# EAGLE schematic Arduino (EAGLE 9.1.3)
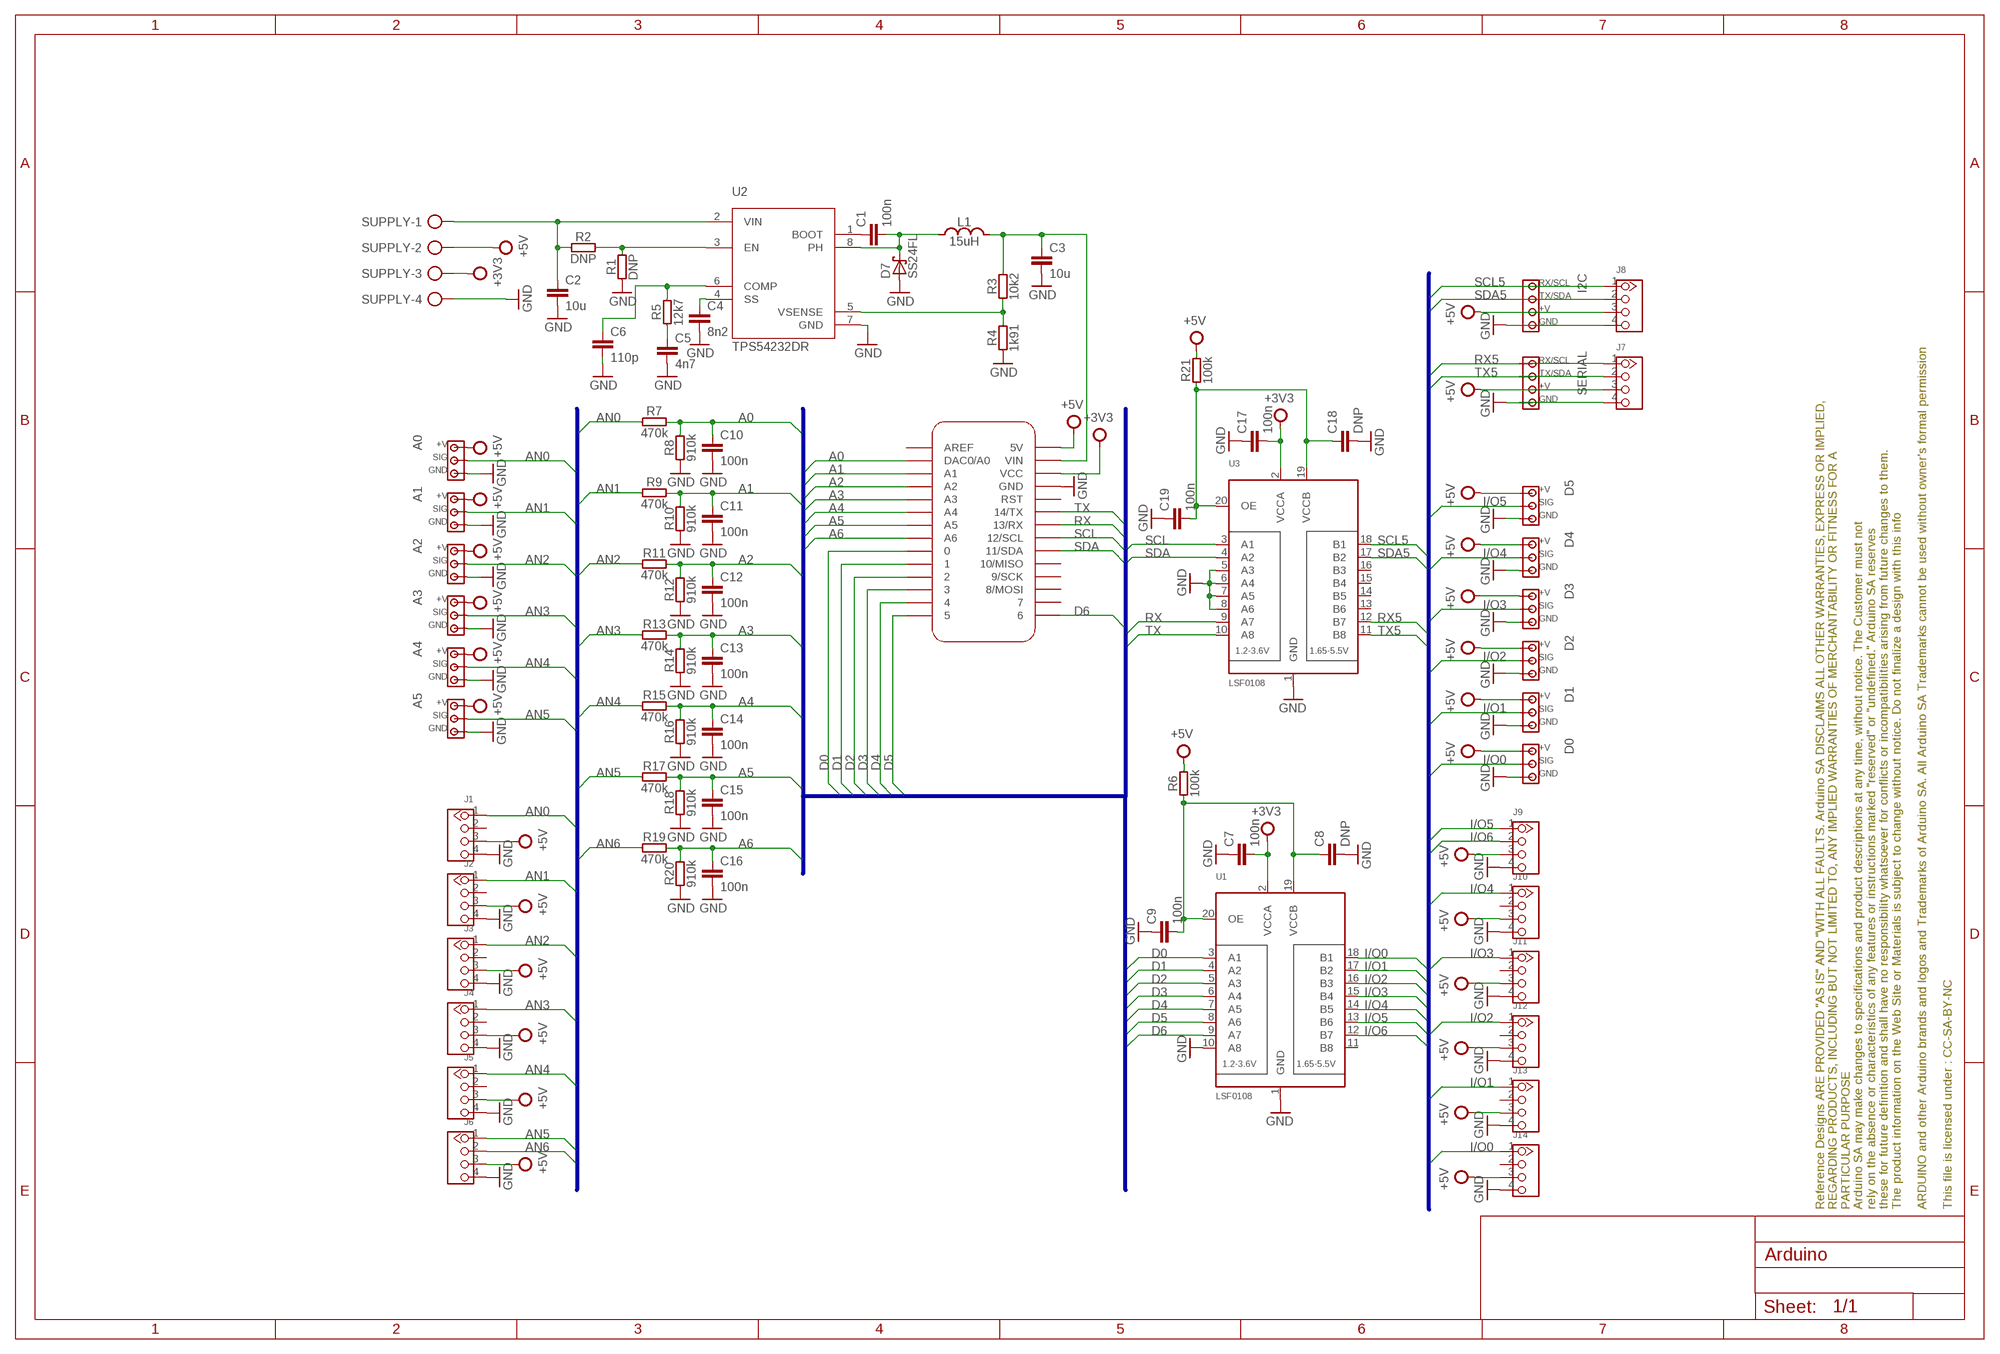
[diagram p0: schematic, sheet 1]

## Parts
A0  DNP  MODULINO-3-DNPSM  [MODULINO-3SM]
A1  DNP  MODULINO-3-DNPSM  [MODULINO-3SM]
A2  DNP  MODULINO-3-DNPSM  [MODULINO-3SM]
A3  DNP  MODULINO-3-DNPSM  [MODULINO-3SM]
A4  DNP  MODULINO-3-DNPSM  [MODULINO-3SM]
A5  DNP  MODULINO-3-DNPSM  [MODULINO-3SM]
B1  DNP  MKRBOARDNO-OUTLINE  [MKRBOARD-NOOUTLINE]
C1  100n  C-100NF-0402  [0402-1005X55N]
C2  10u  C-10UF-0603  [0603-1608X90N]
C3  10u  C-10UF-0603  [0603-1608X90N]
C4  8n2  C-8N2-0402  [0402-1005X55N]
C5  4n7  C-4N7-0402  [0402-1005X55N]
C6  110p  C-110P-0402  [0402-1005X55N]
C7  100n  C-100NF-0402  [0402-1005X55N]
C8  DNP  CDNP-0402  [0402-1005X55N]
C9  100n  C-100NF-0402  [0402-1005X55N]
C10  100n  C-100NF-0402  [0402-1005X55N]
C11  100n  C-100NF-0402  [0402-1005X55N]
C12  100n  C-100NF-0402  [0402-1005X55N]
C13  100n  C-100NF-0402  [0402-1005X55N]
C14  100n  C-100NF-0402  [0402-1005X55N]
C15  100n  C-100NF-0402  [0402-1005X55N]
C16  100n  C-100NF-0402  [0402-1005X55N]
C17  100n  C-100NF-0402  [0402-1005X55N]
C18  DNP  CDNP-0402  [0402-1005X55N]
C19  100n  C-100NF-0402  [0402-1005X55N]
D0  DNP  MODULINO-3-DNPSM  [MODULINO-3SM]
D1  DNP  MODULINO-3-DNPSM  [MODULINO-3SM]
D2  DNP  MODULINO-3-DNPSM  [MODULINO-3SM]
D3  DNP  MODULINO-3-DNPSM  [MODULINO-3SM]
D4  DNP  MODULINO-3-DNPSM  [MODULINO-3SM]
D5  DNP  MODULINO-3-DNPSM  [MODULINO-3SM]
D7  SS24FL  [SOD123F]
FRAME1  DNP  A3-FRAME-STANDARD  [FRAME]
I2C  DNP  MODULINO-4-DNPSM  [MODULINO-4SM]
J1  -  GROVE-CONNECTOR  [HW4-2.0]
J2  -  GROVE-CONNECTOR  [HW4-2.0]
J3  -  GROVE-CONNECTOR  [HW4-2.0]
J4  -  GROVE-CONNECTOR  [HW4-2.0]
J5  -  GROVE-CONNECTOR  [HW4-2.0]
J6  -  GROVE-CONNECTOR  [HW4-2.0]
J7  -  GROVE-CONNECTOR  [HW4-2.0]
J8  -  GROVE-CONNECTOR  [HW4-2.0]
J9  -  GROVE-CONNECTOR  [HW4-2.0]
J10  -  GROVE-CONNECTOR  [HW4-2.0]
J11  -  GROVE-CONNECTOR  [HW4-2.0]
J12  -  GROVE-CONNECTOR  [HW4-2.0]
J13  -  GROVE-CONNECTOR  [HW4-2.0]
J14  -  GROVE-CONNECTOR  [HW4-2.0]
L1  15uH  LSRN  [SRN6045]
R1  DNP  R-DNP-0402  [0402-1005X55N]
R2  DNP  R-DNP-0402  [0402-1005X55N]
R3  10k2  R-10K2-0402  [0402-1005X55N]
R4  1k91  R-1K91-0402  [0402-1005X55N]
R5  12k7  R-12K7-0402  [0402-1005X55N]
R6  100k  R-100K-0402  [0402-1005X55N]
R7  470k  R-470K-0402  [0402-1005X55N]
R8  910k  R-910K-0402  [0402-1005X55N]
R9  470k  R-470K-0402  [0402-1005X55N]
R10  910k  R-910K-0402  [0402-1005X55N]
R11  470k  R-470K-0402  [0402-1005X55N]
R12  910k  R-910K-0402  [0402-1005X55N]
R13  470k  R-470K-0402  [0402-1005X55N]
R14  910k  R-910K-0402  [0402-1005X55N]
R15  470k  R-470K-0402  [0402-1005X55N]
R16  910k  R-910K-0402  [0402-1005X55N]
R17  470k  R-470K-0402  [0402-1005X55N]
R18  910k  R-910K-0402  [0402-1005X55N]
R19  470k  R-470K-0402  [0402-1005X55N]
R20  910k  R-910K-0402  [0402-1005X55N]
R21  100k  R-100K-0402  [0402-1005X55N]
SERIAL  DNP  MODULINO-4-DNPSM  [MODULINO-4SM]
SUPPLY  -  AK300/4  [AK300/4]
U1  LSF0108  LSF0108PWR  [TSSOP20]
U2  TPS54232DR  TPS54232  [SO08]
U3  LSF0108  LSF0108PWR  [TSSOP20]

## Nets
+3V3: B1.VCC C7.2 C17.2 SUPPLY.3 U1.2(VCCA) U3.2(VCCA)
+5V: A0.1 A1.1 A2.1 A3.1 A4.1 A5.1 B1.5V D0.1 D1.1 D2.1 D3.1 D4.1 D5.1 I2C.3 J1.3 J2.3 J3.3 J4.3 J5.3 J6.3 J7.3 J8.3 J9.3 J10.3 J11.3 J12.3 J13.3 J14.3 R6.2 R21.2 SERIAL.3 SUPPLY.2
A0: B1.A0(DAC0/A0) C10.1 R7.2 R8.2
A1: B1.A1 C11.1 R9.2 R10.2
A2: B1.A2 C12.1 R11.2 R12.2
A3: B1.A3 C13.1 R13.2 R14.2
A4: B1.A4 C14.1 R15.2 R16.2
A5: B1.A5 C15.1 R17.2 R18.2
A6: B1.A6 C16.1 R19.2 R20.2
AN0: A0.2 J1.1 R7.1
AN1: A1.2 J2.1 R9.1
AN2: A2.2 J3.1 R11.1
AN3: A3.2 J4.1 R13.1
AN4: A4.2 J5.1 R15.1
AN5: A5.2 J6.1 R17.1
AN6: J6.2 R19.1
D0: B1.0 U1.3(A1)
D1: B1.1 U1.4(A2)
D2: B1.2 U1.5(A3)
D3: B1.3 U1.6(A4)
D4: B1.4 U1.7(A5)
D5: B1.5 U1.8(A6)
D6: B1.6 U1.9(A7)
GND: A0.3 A1.3 A2.3 A3.3 A4.3 A5.3 B1.GND C2.2 C3.2 C4.2 C5.2 C6.2 C7.1 C8.2 C9.1 C10.2 C11.2 C12.2 C13.2 C14.2 C15.2 C16.2 C17.1 C18.2 C19.1 D0.3 D1.3 D2.3 D3.3 D4.3 D5.3 D7.A I2C.4 J1.4 J2.4 J3.4 J4.4 J5.4 J6.4 J7.4 J8.4 J9.4 J10.4 J11.4 J12.4 J13.4 J14.4 R1.1 R4.1 R8.1 R10.1 R12.1 R14.1 R16.1 R18.1 R20.1 SERIAL.4 SUPPLY.4 U1.1(GND) U1.10(A8) U2.7(GND) U3.1(GND) U3.5(A3) U3.6(A4) U3.7(A5) U3.8(A6)
I/O0: D0.2 J14.1 U1.18(B1)
I/O1: D1.2 J13.1 U1.17(B2)
I/O2: D2.2 J12.1 U1.16(B3)
I/O3: D3.2 J11.1 U1.15(B4)
I/O4: D4.2 J10.1 U1.14(B5)
I/O5: D5.2 J9.1 U1.13(B6)
I/O6: J9.2 U1.12(B7)
N$1: C2.1 R2.1 SUPPLY.1 U2.2(VIN)
N$2: R1.2 R2.2 U2.3(EN)
N$3: C1.1 U2.1(BOOT)
N$4: C1.2 D7.C L1.1 U2.8(PH)
N$5: C4.1 U2.4(SS)
N$6: R3.1 R4.2 U2.5(VSENSE)
N$7: C6.1 R5.2 U2.6(COMP)
N$8: C5.1 R5.1
N$9: C8.1 C9.2 R6.1 U1.19(VCCB) U1.20(OE)
N$10: C18.1 C19.2 R21.1 U3.19(VCCB) U3.20(OE)
RX: B1.13(13/RX) U3.9(A7)
RX5: J7.1 SERIAL.1 U3.12(B7)
SCL: B1.12(12/SCL) U3.3(A1)
SCL5: I2C.1 J8.1 U3.18(B1)
SDA: B1.11(11/SDA) U3.4(A2)
SDA5: I2C.2 J8.2 U3.17(B2)
TX: B1.14(14/TX) U3.10(A8)
TX5: J7.2 SERIAL.2 U3.11(B8)
VIN: B1.VIN C3.1 L1.2 R3.2
Unconnected: B1.7 B1.8(8/MOSI) B1.9(9/SCK) B1.10(10/MISO) B1.AREF B1.RST J1.2 J2.2 J3.2 J4.2 J5.2 J10.2 J11.2 J12.2 J13.2 J14.2 U1.11(B8) U3.13(B6) U3.14(B5) U3.15(B4) U3.16(B3)

## Buses
A0,A1,A2,A3,A4,A5,A6,VA0,VA1,VA2,VA3,VA4,VA5,VA6
D0,D1,D2,D3,D4,D5,D6,VD0,VD1,VD2,VD3,VD4,VD5,VD6,SDA,SCL,TX,RX
B$1
B$2

## Library data of the parts
A0 A1-A5 D0 D1-D5 = Arduino-connectors:MODULINO-3: Modulino 4 connector; DATASHEET: DNP; DISTRIBUTOR-LINK: DNP; DISTRIBUTOR-PN: DNP; MANUFACTURER: DNP; MANUFACTURER-PN: DNP
B1 = Arduino-utility:MKRBOARD: MKR board footprint; CODE-ARDUINO: DNP; DATASHEET: DNP; DISTRIBUTOR-LINK: DNP; DISTRIBUTOR-PN: DNP; MANUFACTURER: DNP; MANUFACTURER-PN: DNP
C1 C7 C9-C17 C19 = Arduino-rcl:C: SMD Capacitor; CODE-ARDUINO: 0132; DATASHEET: http://www.tdk.com/pdf/TDKMLCCCapRange.pdf; DISTRIBUTOR-LINK: http://www.digikey.com/product-detail/en/tdk-corporation/C1005X5R1H104K050BB/445-5942-1-ND/2443982; DISTRIBUTOR-PN: 445-5942-1-ND; MANUFACTURER: TDK; MANUFACTURER-PN: C1005X5R1H104K050BB
C2 C3 = Arduino-rcl:C: SMD Capacitor; CODE-ARDUINO: 2213; DATASHEET: http://www.murata.com/~/media/webrenewal/support/library/catalog/products/capacitor/mlcc/c02e.pdf; DISTRIBUTOR-LINK: http://www.digikey.com/product-search/en?keywords=490-10728-1-ND; DISTRIBUTOR-PN: 490-10728-1-ND; MANUFACTURER: Murata; MANUFACTURER-PN: GRM188R61C106KAALD
C4 = Arduino-rcl:C: SMD Capacitor; CODE-ARDUINO: 2263; DATASHEET: http://www.yageo.com/documents/recent/UPY-GPHC_X7R_6.3V-to-50V_18.pdf; DISTRIBUTOR-LINK: https://www.digikey.com/product-detail/en/yageo/CC0402KRX7R7BB822/311-1041-1-ND/302958; DISTRIBUTOR-PN: 311-1041-1-ND; MANUFACTURER: Yageo; MANUFACTURER-PN: CC0402KRX7R7BB822
C5 = Arduino-rcl:C: SMD Capacitor; CODE-ARDUINO: 2266; DATASHEET: http://search.murata.co.jp/Ceramy/image/img/A01X/partnumbering_e_01.pdf; DISTRIBUTOR-LINK: https://www.digikey.com/product-detail/en/murata-electronics-north-america/GRM155R71H472KA01J/490-8259-1-ND/4380553; DISTRIBUTOR-PN: 490-8259-1-ND; MANUFACTURER: Murata; MANUFACTURER-PN: GRM155R71H472KA01J
C6 = Arduino-rcl:C: SMD Capacitor; CODE-ARDUINO: 2264; DATASHEET: http://search.murata.co.jp/Ceramy/image/img/A01X/G101/ENG/GRM1555C1H111GA01-01.pdf; DISTRIBUTOR-LINK: https://www.digikey.com/product-detail/en/murata-electronics-north-america/GRM1555C1H111GA01D/490-6195-1-ND/3845392; DISTRIBUTOR-PN: 490-6195-1-ND; MANUFACTURER: Murata; MANUFACTURER-PN: GRM1555C1H111GA01D
C8 C18 = Arduino-rcl:C: SMD Capacitor; CODE-ARDUINO: DNP; DATASHEET: DNP; DISTRIBUTOR-LINK: DNP; DISTRIBUTOR-PN: DNP; MANUFACTURER: DNP; MANUFACTURER-PN: DNP
D7 = Arduino-diodes:SS24FL: Schotky diode; CODE-ARDUINO: 2262; DATASHEET: https://www.fairchildsemi.com/datasheets/SS/SS24FL.pdf; DISTRIBUTOR-LINK: https://www.digikey.com/product-detail/en/fairchild-on-semiconductor/SS24FL/SS24FLCT-ND/5305093; DISTRIBUTOR-PN: SS24FLCT-ND; MANUFACTURER: Fairchild; MANUFACTURER-PN: SS24FL
FRAME1 = Arduino-utility:A3-FRAME: Schematic frame; CODE-ARDUINO: DNP; DATASHEET: DNP; DISTRIBUTOR-LINK: DNP; DISTRIBUTOR-PN: DNP; MANUFACTURER: DNP; MANUFACTURER-PN: DNP
I2C SERIAL = Arduino-connectors:MODULINO-4: Modulino 4 connector; DATASHEET: DNP; DISTRIBUTOR-LINK: DNP; DISTRIBUTOR-PN: DNP; MANUFACTURER: DNP; MANUFACTURER-PN: DNP
J1-J14 = Arduino-connectors:GROVE-CONNECTOR: Grove connector; CODE-ARDUINO: 2340; DATASHEET: http://www.jst-mfg.com/product/pdf/eng/ePH.pdf; DISTRIBUTOR-LINK: https://www.digikey.com/product-detail/en/jst-sales-america-inc/B4B-PH-K-S(LF)(SN)/455-1706-ND/926613; DISTRIBUTOR-PN: 455-1706-ND; MANUFACTURER: JST; MANUFACTURER-PN: B4B-PH-K-S(LF)(SN)
L1 = Arduino-rcl:L: Inductors; CODE-ARDUINO: 2261; DATASHEET: http://pdf1.alldatasheet.com/datasheet-pdf/view/442254/BOURNS/SRN6045-150M.html; DISTRIBUTOR-LINK: https://www.digikey.com/product-detail/en/bourns-inc/SRN6045-150M/SRN6045-150MCT-ND/2756165; DISTRIBUTOR-PN: SRN6045-150M; MANUFACTURER: Bourns; MANUFACTURER-PN: SRN6045-150M
R1 R2 = Arduino-rcl:R: SMD Resistor; CODE-ARDUINO: DNP; DATASHEET: DNP; DISTRIBUTOR-LINK: DNP; DISTRIBUTOR-PN: DNP; MANUFACTURER: DNP; MANUFACTURER-PN: DNP; _RESTRICTIONS: NO
R3 = Arduino-rcl:R: SMD Resistor; CODE-ARDUINO: 2265; DATASHEET: www.yageo.com.tw/exep/pages/download/literatures/PYu-R_INT-thick_7.pdf; DISTRIBUTOR-LINK: https://www.digikey.com/product-detail/en/yageo/RT0402DRD0710K2L/311-2129-1-ND/6128548; DISTRIBUTOR-PN: 311-2129-1-ND; MANUFACTURER: Yageo; MANUFACTURER-PN: RT0402DRD0710K2L; _RESTRICTIONS: NO
R4 = Arduino-rcl:R: SMD Resistor; CODE-ARDUINO: 2267; DATASHEET: www.yageo.com.tw/exep/pages/download/literatures/PYu-R_INT-thick_7.pdf; DISTRIBUTOR-LINK: https://www.digikey.com/product-detail/en/yageo/RC0402FR-071K91L/YAG3049CT-ND/5281914; DISTRIBUTOR-PN: YAG3049CT-ND; MANUFACTURER: Yageo; MANUFACTURER-PN: RC0402FR-071K91L; _RESTRICTIONS: NO
R5 = Arduino-rcl:R: SMD Resistor; CODE-ARDUINO: 2260; DATASHEET: www.yageo.com.tw/exep/pages/download/literatures/PYu-R_INT-thick_7.pdf; DISTRIBUTOR-LINK: https://www.digikey.com/product-detail/en/yageo/RC0402FR-0712K7L/YAG2964CT-ND/5281829; DISTRIBUTOR-PN: YAG2964CT-ND; MANUFACTURER: Yageo; MANUFACTURER-PN: RC0402FR-0712K7L; _RESTRICTIONS: NO
R6 R21 = Arduino-rcl:R: SMD Resistor; CODE-ARDUINO: 0134; DATASHEET: www.yageo.com.tw/exep/pages/download/literatures/PYu-R_INT-thick_7.pdf; DISTRIBUTOR-LINK: http://www.digikey.com/product-detail/en/yageo/RC0402FR-07100KL/311-100KLRCT-ND/729473; DISTRIBUTOR-PN: 311-100KLRCT-ND; MANUFACTURER: Yageo; MANUFACTURER-PN: RC0402FR-07100KL; _RESTRICTIONS: NO
R7 R9 R11 R13 R15 R17 R19 = Arduino-rcl:R: SMD Resistor; CODE-ARDUINO: -; DATASHEET: www.yageo.com.tw/exep/pages/download/literatures/PYu-R_INT-thick_7.pdf; DISTRIBUTOR-LINK: https://www.digikey.com/product-detail/en/yageo/RC0402JR-07470KL/311-470KJRCT-ND/729430; DISTRIBUTOR-PN: 311-470KJRCT-ND; MANUFACTURER: Yageo; MANUFACTURER-PN: RC0402JR-07470KL; _RESTRICTIONS: NO
R8 R10 R12 R14 R16 R18 R20 = Arduino-rcl:R: SMD Resistor; CODE-ARDUINO: -; DATASHEET: www.yageo.com.tw/exep/pages/download/literatures/PYu-R_INT-thick_7.pdf; DISTRIBUTOR-LINK: https://www.digikey.com/product-detail/en/yageo/RC0402FR-07910KL/YAG3257CT-ND/5282123; DISTRIBUTOR-PN: YAG3257CT-ND; MANUFACTURER: Yageo; MANUFACTURER-PN: RC0402FR-07910KL; _RESTRICTIONS: NO
SUPPLY = Arduino-connectors:AK300/4: CONNECTOR; CODE-ARDUINO: 2342; DATASHEET: http://www.on-shore.com/wp-content/uploads/2015/09/osttcxx0162.pdf; DISTRIBUTOR-LINK: https://www.digikey.com/product-detail/en/on-shore-technology-inc/OSTTC040162/ED2602-ND/614551; DISTRIBUTOR-PN: ED2602-ND; MANUFACTURER: On Shore; MANUFACTURER-PN: OSTTC040162
U1 U3 = Arduino-ICs:LSF0108PWR: Voltage Level Translator Bidirectional 1 Circuit 8 Channel 100Mbps; CODE-ARDUINO: 2204; DATASHEET: http://www.ti.com/lit/ds/symlink/lsf0108.pdf; DISTRIBUTOR-LINK: https://www.digikey.com/product-detail/en/texas-instruments/LSF0108PWR/296-37828-1-ND/4876357; DISTRIBUTOR-PN: 296-37828-1-ND; MANUFACTURER: Texas Instruments; MANUFACTURER-PN: LSF0108PWR
U2 = Arduino-ICs:TPS54232: Buck converter IC; CODE-ARDUINO: 2269; DATASHEET: http://www.ti.com/lit/ds/symlink/tps54232.pdf; DISTRIBUTOR-LINK: https://www.digikey.com/product-detail/en/texas-instruments/TPS54232DR/296-39414-1-ND/5143365; DISTRIBUTOR-PN: 296-39414-1-ND; MANUFACTURER: Texas Instruments; MANUFACTURER-PN: TPS54232DR